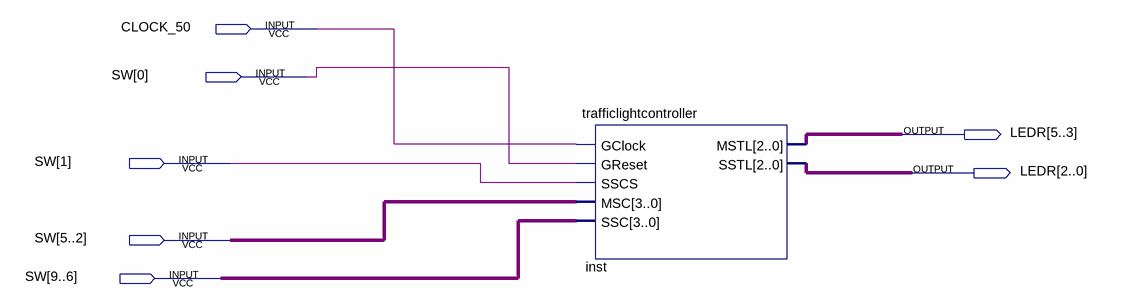
[diagram p0: schematic sheet]
// Quartus schematic lab3_top.bdf as structural Verilog: 1 symbols, 7 pins
module lab3_top (
  input  CLOCK_50,
  input  [9:0] SW,
  output [5:0] LEDR
);

  trafficlightcontroller inst (
    .GClock(CLOCK_50), .GReset(SW[0]), .SSCS(SW[1]), .MSC(SW[5:2]), .SSC(SW[9:6]), .MSTL(LEDR[5:3]),
    .SSTL(LEDR[2:0]));
endmodule
